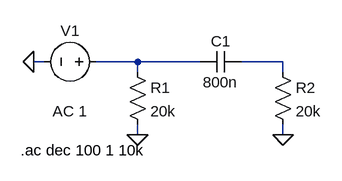
[diagram p0: schematic Draft2.asc]
Draft2.asc, the LTspice schematic file:
Version 4
SHEET 1 880 680
WIRE -176 112 -192 112
WIRE -32 112 -96 112
WIRE 64 112 -32 112
WIRE 192 112 128 112
WIRE -32 128 -32 112
WIRE 192 128 192 112
WIRE -32 224 -32 208
WIRE 192 224 192 208
FLAG 192 224 0
FLAG -32 224 0
FLAG -192 112 0
SYMBOL res -48 112 R0
SYMATTR InstName R1
SYMATTR Value 20k
SYMBOL res 176 112 R0
SYMATTR InstName R2
SYMATTR Value 20k
SYMBOL cap 128 96 R90
WINDOW 0 0 32 VBottom 2
WINDOW 3 32 32 VTop 2
SYMATTR InstName C1
SYMATTR Value 800n
SYMBOL voltage -80 112 R90
WINDOW 0 -32 56 VBottom 2
WINDOW 3 32 56 VTop 2
WINDOW 123 60 56 VTop 2
WINDOW 39 0 0 Left 0
SYMATTR InstName V1
SYMATTR Value ""
SYMATTR Value2 AC 1
TEXT -212 248 Left 2 !.ac dec 100 1 10k

The netlist it stands for:
* Draft2.asc
R1 N001 0 20k
R2 N002 0 20k
C1 N002 N001 800n
V1 N001 0 AC 1
.ac dec 100 1 10k
.backanno
.end